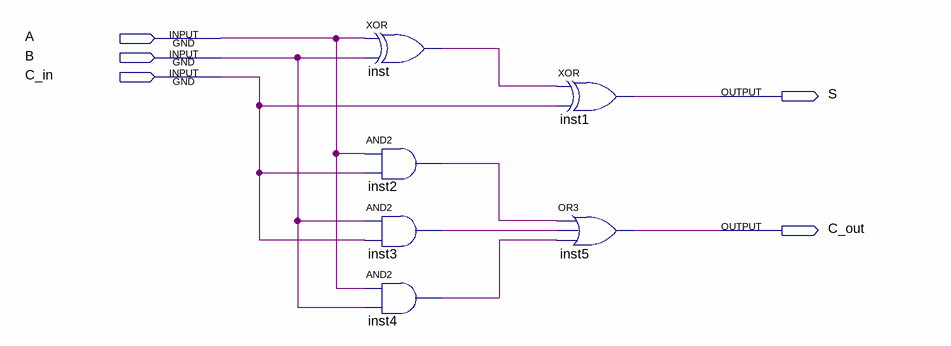
[diagram p0: schematic sheet]
// Quartus schematic full_adder.bdf as structural Verilog: 6 symbols, 5 pins
module full_adder (
  input  A,
  input  B,
  input  C_in,
  output S,
  output C_out
);

  wire inst2_out, inst3_out, inst4_out, inst_out;

  xor inst (inst_out, A, B);
  and inst2 (inst2_out, A, C_in);
  and inst3 (inst3_out, B, C_in);
  and inst4 (inst4_out, A, B);
  xor inst1 (S, inst_out, C_in);
  or inst5 (C_out, inst2_out, inst3_out, inst4_out);
endmodule
